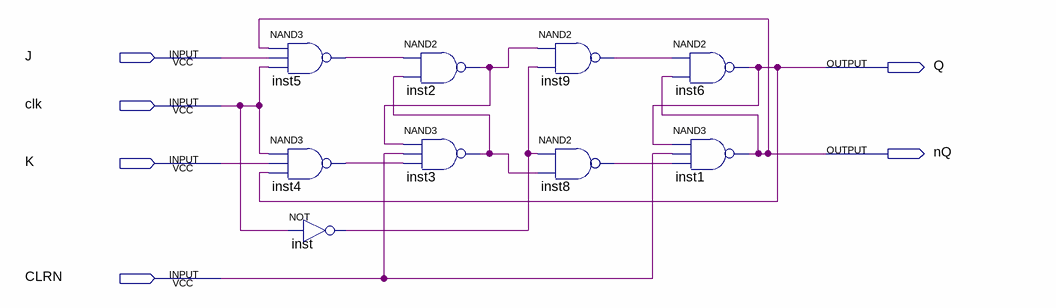
[diagram p0: schematic sheet]
// Quartus schematic JK_FlipFlop.bdf as structural Verilog: 9 symbols, 6 pins
module JK_FlipFlop (
  input  J,
  input  clk,
  input  K,
  input  CLRN,
  output Q,
  output nQ
);

  wire inst2_out, inst3_out, inst4_out, inst5_out, inst8_out, inst9_out, inst_out;

  nand inst5 (inst5_out, nQ, J, clk);
  nand inst4 (inst4_out, clk, K, Q);
  not inst (inst_out, clk);
  nand inst2 (inst2_out, inst5_out, inst3_out);
  nand inst3 (inst3_out, inst2_out, CLRN, inst4_out);
  nand inst9 (inst9_out, inst2_out, inst_out);
  nand inst8 (inst8_out, inst_out, inst3_out);
  nand inst6 (Q, inst9_out, nQ);
  nand inst1 (nQ, Q, CLRN, inst8_out);
endmodule
